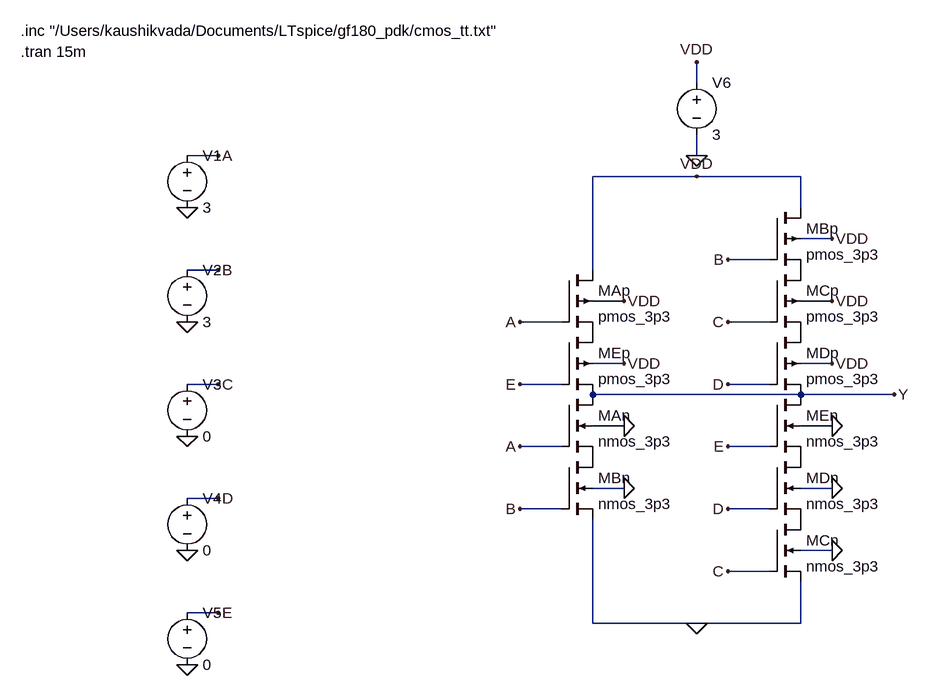
[diagram p0: schematic Q2_1 copy.asc]
Q2_1 copy.asc, the LTspice schematic file:
Version 4
SHEET 1 1600 1200
WIRE 960 16 960 48
WIRE 960 128 960 160
WIRE 800 192 1120 192
WIRE 800 192 800 336
WIRE 1120 192 1120 240
WIRE 800 528 1120 528
WIRE 1120 528 1264 528
WIRE 800 720 800 880
WIRE 1120 816 1120 880
WIRE 800 880 1120 880
WIRE 176 160 224 160
WIRE 176 336 224 336
WIRE 176 512 224 512
WIRE 176 688 224 688
WIRE 176 864 224 864
WIRE 688 416 752 416
WIRE 688 512 752 512
WIRE 1008 320 1072 320
WIRE 1008 416 1072 416
WIRE 1008 512 1072 512
WIRE 688 608 752 608
WIRE 688 704 752 704
WIRE 1008 608 1072 608
WIRE 1008 704 1072 704
WIRE 1008 800 1072 800
WIRE 800 384 848 384
WIRE 800 480 848 480
WIRE 1120 288 1168 288
WIRE 1120 384 1168 384
WIRE 1120 480 1168 480
WIRE 800 576 848 576
WIRE 800 672 848 672
WIRE 1120 576 1168 576
WIRE 1120 672 1168 672
WIRE 1120 768 1168 768
FLAG 960 16 VDD
FLAG 960 160 0
FLAG 960 192 VDD
FLAG 960 880 0
FLAG 224 160 A
FLAG 224 336 B
FLAG 224 512 C
FLAG 224 688 D
FLAG 224 864 E
FLAG 176 240 0
FLAG 176 416 0
FLAG 176 592 0
FLAG 176 768 0
FLAG 176 944 0
FLAG 688 416 A
FLAG 688 512 E
FLAG 1008 320 B
FLAG 1008 416 C
FLAG 1008 512 D
FLAG 688 608 A
FLAG 688 704 B
FLAG 1008 608 E
FLAG 1008 704 D
FLAG 1008 800 C
FLAG 848 384 VDD
FLAG 848 480 VDD
FLAG 1168 288 VDD
FLAG 1168 384 VDD
FLAG 1168 480 VDD
FLAG 848 576 0
FLAG 848 672 0
FLAG 1168 576 0
FLAG 1168 672 0
FLAG 1168 768 0
FLAG 1264 528 Y
SYMBOL voltage 960 32 R0
SYMATTR InstName V6
SYMATTR Value 3
SYMBOL voltage 176 144 R0
SYMATTR InstName V1
SYMATTR Value 3
SYMBOL voltage 176 320 R0
SYMATTR InstName V2
SYMATTR Value 3
SYMBOL voltage 176 496 R0
SYMATTR InstName V3
SYMATTR Value 0
SYMBOL voltage 176 672 R0
SYMATTR InstName V4
SYMATTR Value 0
SYMBOL voltage 176 848 R0
SYMATTR InstName V5
SYMATTR Value 0
SYMBOL pmos4 752 336 R0
SYMATTR InstName MAp
SYMATTR Value pmos_3p3
SYMBOL pmos4 752 432 R0
SYMATTR InstName MEp
SYMATTR Value pmos_3p3
SYMBOL pmos4 1072 240 R0
SYMATTR InstName MBp
SYMATTR Value pmos_3p3
SYMBOL pmos4 1072 336 R0
SYMATTR InstName MCp
SYMATTR Value pmos_3p3
SYMBOL pmos4 1072 432 R0
SYMATTR InstName MDp
SYMATTR Value pmos_3p3
SYMBOL nmos4 752 528 R0
SYMATTR InstName MAn
SYMATTR Value nmos_3p3
SYMBOL nmos4 752 624 R0
SYMATTR InstName MBn
SYMATTR Value nmos_3p3
SYMBOL nmos4 1072 528 R0
SYMATTR InstName MEn
SYMATTR Value nmos_3p3
SYMBOL nmos4 1072 624 R0
SYMATTR InstName MDn
SYMATTR Value nmos_3p3
SYMBOL nmos4 1072 720 R0
SYMATTR InstName MCn
SYMATTR Value nmos_3p3
TEXT -80 -32 Left 2 !.inc "/Users/kaushikvada/Documents/LTspice/gf180_pdk/cmos_tt.txt"
TEXT -80 0 Left 2 !.tran 15m

The netlist it stands for:
* Q2_1 copy.asc
V6 VDD 0 3
V1 A 0 3
V2 B 0 3
V3 C 0 0
V4 D 0 0
V5 E 0 0
MAp VDD A P001 VDD pmos_3p3
MEp P001 E Y VDD pmos_3p3
MBp VDD B P002 VDD pmos_3p3
MCp P002 C P003 VDD pmos_3p3
MDp P003 D Y VDD pmos_3p3
MAn Y A P004 0 nmos_3p3
MBn P004 B 0 0 nmos_3p3
MEn Y E P005 0 nmos_3p3
MDn P005 D P006 0 nmos_3p3
MCn P006 C 0 0 nmos_3p3
.model NMOS NMOS
.model PMOS PMOS
.lib standard.mos
.inc "/Users/kaushikvada/Documents/LTspice/gf180_pdk/cmos_tt.txt"
.tran 15m
.backanno
.end